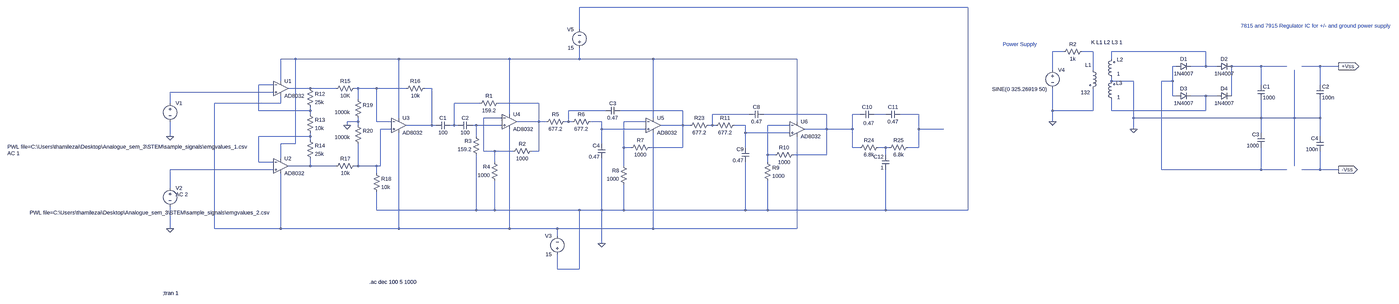
[diagram p0: schematic complete.asc, whole sheet]
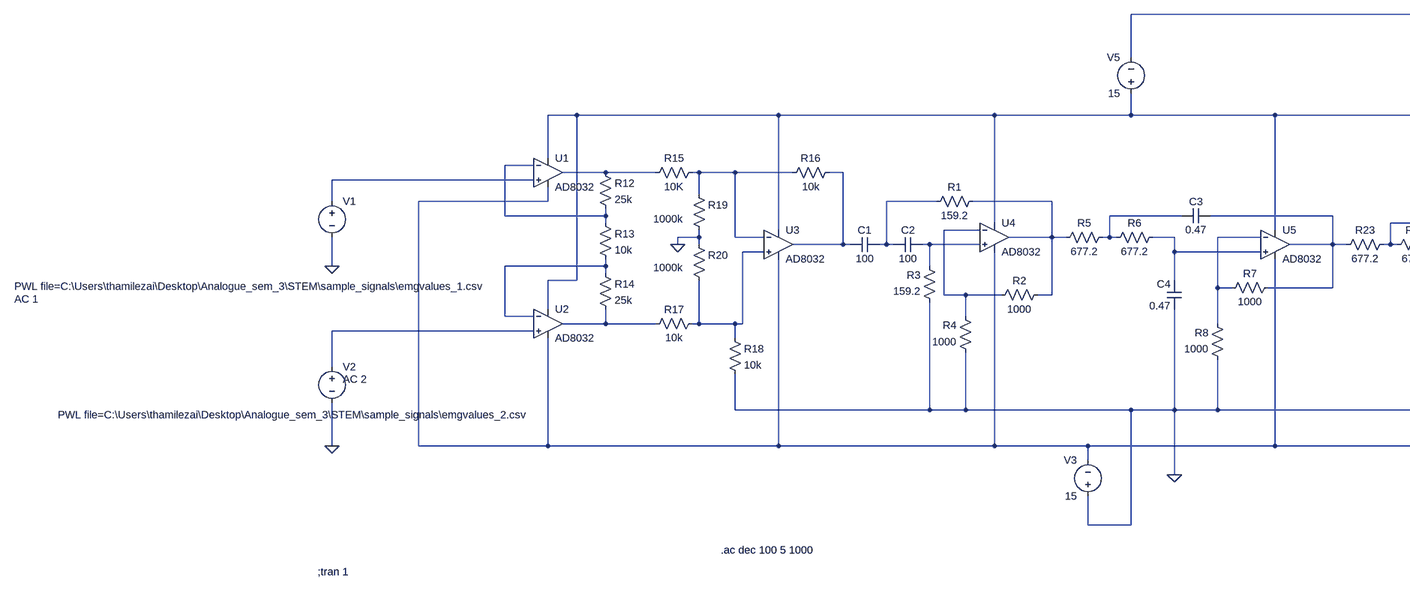
[diagram p1: schematic complete.asc, part, row 1 of 1, column 1 of 2]
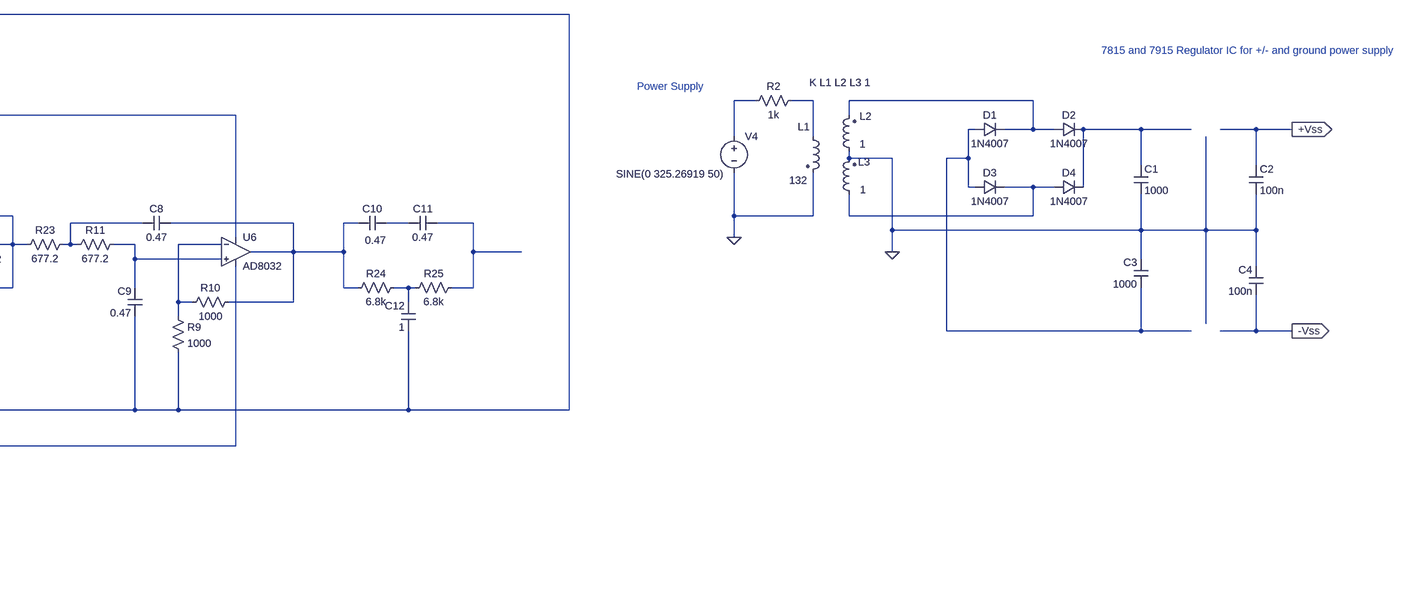
[diagram p2: schematic complete.asc, part, row 1 of 1, column 2 of 2]
complete.asc, the LTspice schematic file:
Version 4
SHEET 1 3992 3368
WIRE -784 912 -2528 912
WIRE -2528 1008 -2528 912
WIRE 272 1104 224 1104
WIRE 400 1104 352 1104
WIRE 944 1104 480 1104
WIRE -3760 1136 -3824 1136
WIRE -3312 1136 -3760 1136
WIRE -2832 1136 -3312 1136
WIRE -2528 1136 -2528 1088
WIRE -2528 1136 -2832 1136
WIRE -2208 1136 -2528 1136
WIRE -1584 1136 -2208 1136
WIRE 480 1136 480 1104
WIRE 816 1168 800 1168
WIRE 944 1168 944 1104
WIRE 944 1168 880 1168
WIRE 992 1168 944 1168
WIRE 1184 1168 1056 1168
WIRE 1296 1168 1184 1168
WIRE 1440 1168 1360 1168
WIRE 1520 1168 1440 1168
WIRE 224 1184 224 1104
WIRE 400 1184 400 1104
WIRE -3824 1232 -3824 1136
WIRE 480 1232 480 1216
WIRE 576 1232 480 1232
WIRE 800 1232 800 1168
WIRE 800 1232 752 1232
WIRE -3856 1248 -3920 1248
WIRE 1184 1248 1184 1168
WIRE 1440 1248 1440 1168
WIRE -3696 1264 -3792 1264
WIRE -3584 1264 -3696 1264
WIRE -3488 1264 -3504 1264
WIRE -3408 1264 -3488 1264
WIRE -3280 1264 -3408 1264
WIRE -3168 1264 -3200 1264
WIRE -3856 1280 -4304 1280
WIRE 800 1296 800 1232
WIRE 816 1296 800 1296
WIRE 944 1296 880 1296
WIRE 992 1296 944 1296
WIRE 1056 1296 1056 1168
WIRE -3488 1312 -3488 1264
WIRE -4304 1328 -4304 1280
WIRE -3824 1328 -3824 1296
WIRE -3824 1328 -4112 1328
WIRE -2960 1328 -3072 1328
WIRE -2704 1328 -2880 1328
WIRE -3920 1360 -3920 1248
WIRE -3696 1360 -3696 1344
WIRE -3696 1360 -3920 1360
WIRE -2416 1360 -2576 1360
WIRE -2080 1360 -2352 1360
WIRE 224 1360 224 1264
WIRE 400 1360 400 1264
WIRE 400 1360 224 1360
WIRE 480 1360 480 1312
WIRE 944 1360 944 1296
WIRE 944 1360 480 1360
WIRE -3696 1376 -3696 1360
WIRE -2832 1376 -2832 1136
WIRE -1792 1376 -1952 1376
WIRE -1456 1376 -1728 1376
WIRE -1312 1376 -1344 1376
WIRE -1200 1376 -1248 1376
WIRE -1056 1376 -1136 1376
WIRE -3312 1392 -3312 1136
WIRE -2864 1392 -2944 1392
WIRE -2208 1392 -2208 1136
WIRE 576 1392 576 1232
WIRE 1184 1392 1184 1312
WIRE 1184 1392 576 1392
WIRE 1328 1392 1328 1184
WIRE 1328 1392 1184 1392
WIRE 1440 1392 1440 1312
WIRE 1440 1392 1328 1392
WIRE -3488 1408 -3488 1392
WIRE -3488 1408 -3536 1408
WIRE -3408 1408 -3408 1264
WIRE -3344 1408 -3408 1408
WIRE -2704 1408 -2704 1328
WIRE -2704 1408 -2800 1408
WIRE -2672 1408 -2704 1408
WIRE -2576 1408 -2576 1360
WIRE -2576 1408 -2592 1408
WIRE -2560 1408 -2576 1408
WIRE -2432 1408 -2480 1408
WIRE -2240 1408 -2336 1408
WIRE -1584 1408 -1584 1136
WIRE 224 1408 224 1360
WIRE -3536 1424 -3536 1408
WIRE -3488 1424 -3488 1408
WIRE -3168 1424 -3168 1264
WIRE -3168 1424 -3280 1424
WIRE -3152 1424 -3168 1424
WIRE -3072 1424 -3072 1328
WIRE -3072 1424 -3088 1424
WIRE -3056 1424 -3072 1424
WIRE -2976 1424 -2992 1424
WIRE -2864 1424 -2976 1424
WIRE -2080 1424 -2080 1360
WIRE -2080 1424 -2176 1424
WIRE -2048 1424 -2080 1424
WIRE -1952 1424 -1952 1376
WIRE -1952 1424 -1968 1424
WIRE -1936 1424 -1952 1424
WIRE -1808 1424 -1856 1424
WIRE -1616 1424 -1712 1424
WIRE -3344 1440 -3392 1440
WIRE -2432 1440 -2432 1408
WIRE -2240 1440 -2432 1440
WIRE -1456 1440 -1456 1376
WIRE -1456 1440 -1552 1440
WIRE -1344 1440 -1344 1376
WIRE -1344 1440 -1456 1440
WIRE -1056 1440 -1056 1376
WIRE -912 1440 -1056 1440
WIRE 576 1440 576 1392
WIRE -1808 1456 -1808 1424
WIRE -1616 1456 -1808 1456
WIRE 1184 1456 1184 1392
WIRE -4304 1472 -4304 1408
WIRE -3696 1472 -3696 1456
WIRE -3696 1472 -3920 1472
WIRE -2976 1472 -2976 1424
WIRE 1440 1472 1440 1392
WIRE -3696 1488 -3696 1472
WIRE -3760 1504 -3760 1136
WIRE -3760 1504 -3824 1504
WIRE -2432 1504 -2432 1440
WIRE -2336 1520 -2336 1408
WIRE -2304 1520 -2336 1520
WIRE -2080 1520 -2080 1424
WIRE -2080 1520 -2224 1520
WIRE -1808 1520 -1808 1456
WIRE -1344 1520 -1344 1440
WIRE -1312 1520 -1344 1520
WIRE -1200 1520 -1232 1520
WIRE -1184 1520 -1200 1520
WIRE -1056 1520 -1056 1440
WIRE -1056 1520 -1104 1520
WIRE -2944 1536 -2944 1392
WIRE -2896 1536 -2944 1536
WIRE -2816 1536 -2896 1536
WIRE -2704 1536 -2704 1408
WIRE -2704 1536 -2736 1536
WIRE -1712 1552 -1712 1424
WIRE -1680 1552 -1712 1552
WIRE -1456 1552 -1456 1440
WIRE -1456 1552 -1600 1552
WIRE -1200 1552 -1200 1520
WIRE -3824 1568 -3824 1504
WIRE -3920 1584 -3920 1472
WIRE -3856 1584 -3920 1584
WIRE -2896 1584 -2896 1536
WIRE -1712 1584 -1712 1552
WIRE -3696 1600 -3696 1568
WIRE -3696 1600 -3792 1600
WIRE -3584 1600 -3696 1600
WIRE -3488 1600 -3488 1504
WIRE -3488 1600 -3504 1600
WIRE -3408 1600 -3488 1600
WIRE -3392 1600 -3392 1440
WIRE -3392 1600 -3408 1600
WIRE -2336 1600 -2336 1520
WIRE 1328 1600 1328 1392
WIRE -3856 1616 -4304 1616
WIRE 752 1616 752 1232
WIRE 1184 1616 1184 1520
WIRE 1184 1616 752 1616
WIRE 1296 1616 1184 1616
WIRE 1440 1616 1440 1536
WIRE 1440 1616 1360 1616
WIRE 1520 1616 1440 1616
WIRE -3408 1632 -3408 1600
WIRE -4304 1696 -4304 1616
WIRE -3408 1792 -3408 1712
WIRE -2976 1792 -2976 1552
WIRE -2976 1792 -3408 1792
WIRE -2896 1792 -2896 1664
WIRE -2896 1792 -2976 1792
WIRE -2528 1792 -2896 1792
WIRE -2432 1792 -2432 1568
WIRE -2432 1792 -2528 1792
WIRE -2336 1792 -2336 1680
WIRE -2336 1792 -2432 1792
WIRE -1808 1792 -1808 1584
WIRE -1808 1792 -2336 1792
WIRE -1712 1792 -1712 1664
WIRE -1712 1792 -1808 1792
WIRE -1200 1792 -1200 1616
WIRE -1200 1792 -1712 1792
WIRE -784 1792 -784 912
WIRE -784 1792 -1200 1792
WIRE -4304 1872 -4304 1776
WIRE -4112 1872 -4112 1328
WIRE -3824 1872 -3824 1632
WIRE -3824 1872 -4112 1872
WIRE -3312 1872 -3312 1456
WIRE -3312 1872 -3824 1872
WIRE -2832 1872 -2832 1440
WIRE -2832 1872 -3312 1872
WIRE -2624 1872 -2832 1872
WIRE -2208 1872 -2208 1456
WIRE -2208 1872 -2624 1872
WIRE -1584 1872 -1584 1472
WIRE -1584 1872 -2208 1872
WIRE -2624 1904 -2624 1872
WIRE -2432 1936 -2432 1792
WIRE -2624 2048 -2624 1984
WIRE -2528 2048 -2528 1792
WIRE -2528 2048 -2624 2048
FLAG -2432 1936 0
FLAG -4304 1472 0
FLAG -4304 1872 0
FLAG -3536 1424 0
FLAG 224 1408 0
FLAG 576 1440 0
FLAG 1520 1168 +Vss
IOPIN 1520 1168 Out
FLAG 1520 1616 -Vss
IOPIN 1520 1616 Out
SYMBOL cap -3088 1408 R90
WINDOW 0 0 32 VBottom 2
WINDOW 3 32 32 VTop 2
SYMATTR InstName C1
SYMATTR Value 100
SYMBOL cap -2992 1408 R90
WINDOW 0 0 32 VBottom 2
WINDOW 3 32 32 VTop 2
SYMATTR InstName C2
SYMATTR Value 100
SYMBOL res -2864 1312 R90
WINDOW 0 0 56 VBottom 2
WINDOW 3 32 56 VTop 2
SYMATTR InstName R1
SYMATTR Value 159.2
SYMBOL res -2720 1520 R90
WINDOW 0 0 56 VBottom 2
WINDOW 3 32 56 VTop 2
SYMATTR InstName R2
SYMATTR Value 1000
SYMBOL res -2960 1568 R180
WINDOW 0 36 76 Left 2
WINDOW 3 36 40 Left 2
SYMATTR InstName R3
SYMATTR Value 159.2
SYMBOL res -2880 1680 R180
WINDOW 0 36 76 Left 2
WINDOW 3 36 40 Left 2
SYMATTR InstName R4
SYMATTR Value 1000
SYMBOL res -2576 1392 R90
WINDOW 0 0 56 VBottom 2
WINDOW 3 32 56 VTop 2
SYMATTR InstName R5
SYMATTR Value 677.2
SYMBOL res -2464 1392 R90
WINDOW 0 0 56 VBottom 2
WINDOW 3 32 56 VTop 2
SYMATTR InstName R6
SYMATTR Value 677.2
SYMBOL res -2208 1504 R90
WINDOW 0 0 56 VBottom 2
WINDOW 3 32 56 VTop 2
SYMATTR InstName R7
SYMATTR Value 1000
SYMBOL res -2320 1696 R180
WINDOW 0 36 76 Left 2
WINDOW 3 36 40 Left 2
SYMATTR InstName R8
SYMATTR Value 1000
SYMBOL cap -2352 1344 R90
WINDOW 0 0 32 VBottom 2
WINDOW 3 32 32 VTop 2
SYMATTR InstName C3
SYMATTR Value 0.47
SYMBOL cap -2416 1568 R180
WINDOW 0 24 56 Left 2
WINDOW 3 24 8 Left 2
SYMATTR InstName C4
SYMATTR Value 0.47
SYMBOL res -3712 1248 R0
SYMATTR InstName R12
SYMATTR Value 25k
SYMBOL res -3712 1360 R0
SYMATTR InstName R13
SYMATTR Value 10k
SYMBOL res -3712 1472 R0
SYMATTR InstName R14
SYMATTR Value 25k
SYMBOL res -3488 1248 R90
WINDOW 0 0 56 VBottom 2
WINDOW 3 32 56 VTop 2
SYMATTR InstName R15
SYMATTR Value 10K
SYMBOL res -3184 1248 R90
WINDOW 0 0 56 VBottom 2
WINDOW 3 32 56 VTop 2
SYMATTR InstName R16
SYMATTR Value 10k
SYMBOL res -3488 1584 R90
WINDOW 0 0 56 VBottom 2
WINDOW 3 32 56 VTop 2
SYMATTR InstName R17
SYMATTR Value 10k
SYMBOL res -3424 1616 R0
SYMATTR InstName R18
SYMATTR Value 10k
SYMBOL res -3504 1296 R0
WINDOW 3 -86 71 Left 2
SYMATTR Value 1000k
SYMATTR InstName R19
SYMBOL res -3504 1408 R0
WINDOW 3 -86 67 Left 2
SYMATTR Value 1000k
SYMATTR InstName R20
SYMBOL voltage -4304 1312 R0
WINDOW 3 -706 205 Left 2
WINDOW 123 -706 233 Left 2
WINDOW 39 0 0 Left 0
SYMATTR Value PWL file=C:\Users\thamilezai\Desktop\Analogue_sem_3\STEM\sample_signals\emgvalues_1.csv
SYMATTR Value2 AC 1
SYMATTR InstName V1
SYMBOL voltage -4304 1680 R0
WINDOW 3 -609 123 Left 2
WINDOW 123 24 44 Left 2
WINDOW 39 0 0 Left 0
SYMATTR Value PWL file=C:\Users\thamilezai\Desktop\Analogue_sem_3\STEM\sample_signals\emgvalues_2.csv
SYMATTR Value2 AC 2
SYMATTR InstName V2
SYMBOL voltage -2624 2000 R180
WINDOW 0 24 96 Left 2
WINDOW 3 24 16 Left 2
WINDOW 123 0 0 Left 0
WINDOW 39 0 0 Left 0
SYMATTR InstName V3
SYMATTR Value 15
SYMBOL voltage -2528 1104 R180
WINDOW 0 24 96 Left 2
WINDOW 3 24 16 Left 2
WINDOW 123 0 0 Left 0
WINDOW 39 0 0 Left 0
SYMATTR InstName V5
SYMATTR Value 15
SYMBOL OpAmps\\AD8032 -3824 1200 R0
SYMATTR InstName U1
SYMBOL OpAmps\\AD8032 -3824 1536 R0
SYMATTR InstName U2
SYMBOL OpAmps\\AD8032 -3312 1360 R0
SYMATTR InstName U3
SYMBOL OpAmps\\AD8032 -2832 1344 R0
SYMATTR InstName U4
SYMBOL OpAmps\\AD8032 -2208 1360 R0
SYMATTR InstName U5
SYMBOL res -1840 1408 R90
WINDOW 0 0 56 VBottom 2
WINDOW 3 32 56 VTop 2
SYMATTR InstName R11
SYMATTR Value 677.2
SYMBOL cap -1728 1360 R90
WINDOW 0 0 32 VBottom 2
WINDOW 3 32 32 VTop 2
SYMATTR InstName C8
SYMATTR Value 0.47
SYMBOL cap -1792 1584 R180
WINDOW 0 24 56 Left 2
WINDOW 3 24 8 Left 2
SYMATTR InstName C9
SYMATTR Value 0.47
SYMBOL OpAmps\\AD8032 -1584 1376 R0
SYMATTR InstName U6
SYMBOL res -1952 1408 R90
WINDOW 0 0 56 VBottom 2
WINDOW 3 32 56 VTop 2
SYMATTR InstName R23
SYMATTR Value 677.2
SYMBOL cap -1248 1360 R90
WINDOW 0 0 32 VBottom 2
WINDOW 3 39 25 VTop 2
SYMATTR InstName C10
SYMATTR Value 0.47
SYMBOL cap -1136 1360 R90
WINDOW 0 0 32 VBottom 2
WINDOW 3 32 32 VTop 2
SYMATTR InstName C11
SYMATTR Value 0.47
SYMBOL res -1216 1504 R90
WINDOW 0 0 56 VBottom 2
WINDOW 3 32 56 VTop 2
SYMATTR InstName R24
SYMATTR Value 6.8k
SYMBOL res -1088 1504 R90
WINDOW 0 0 56 VBottom 2
WINDOW 3 32 56 VTop 2
SYMATTR InstName R25
SYMATTR Value 6.8k
SYMBOL cap -1184 1616 R180
WINDOW 0 24 56 Left 2
WINDOW 3 24 8 Left 2
SYMATTR InstName C12
SYMATTR Value 1
SYMBOL res -1728 1568 R0
SYMATTR InstName R9
SYMATTR Value 1000
SYMBOL res -1584 1536 R90
WINDOW 0 0 56 VBottom 2
WINDOW 3 32 56 VTop 2
SYMATTR InstName R10
SYMATTR Value 1000
SYMBOL voltage 224 1168 R0
WINDOW 3 -262 99 Left 2
WINDOW 123 0 0 Left 0
WINDOW 39 0 0 Left 0
SYMATTR Value SINE(0 325.26919 50)
SYMATTR InstName V4
SYMBOL ind2 384 1168 R0
WINDOW 0 -18 -6 Left 2
WINDOW 3 -37 113 Left 2
SYMATTR InstName L1
SYMATTR Value 132
SYMATTR Type ind
SYMBOL ind2 496 1232 R180
WINDOW 0 -34 93 Left 2
WINDOW 3 -21 32 Left 2
SYMATTR InstName L2
SYMATTR Value 1
SYMATTR Type ind
SYMBOL res 368 1088 R90
WINDOW 0 0 56 VBottom 2
WINDOW 3 32 56 VTop 2
SYMATTR InstName R2
SYMATTR Value 1k
SYMBOL diode 816 1184 R270
WINDOW 0 32 32 VTop 2
WINDOW 3 0 32 VBottom 2
SYMATTR InstName D1
SYMATTR Value 1N4007
SYMBOL diode 992 1184 R270
WINDOW 0 32 32 VTop 2
WINDOW 3 0 32 VBottom 2
SYMATTR InstName D2
SYMATTR Value 1N4007
SYMBOL diode 816 1312 R270
WINDOW 0 32 32 VTop 2
WINDOW 3 0 32 VBottom 2
SYMATTR InstName D3
SYMATTR Value 1N4007
SYMBOL diode 992 1312 R270
WINDOW 0 32 32 VTop 2
WINDOW 3 0 32 VBottom 2
SYMATTR InstName D4
SYMATTR Value 1N4007
SYMBOL cap 1168 1248 R0
SYMATTR InstName C1
SYMATTR Value 1000
SYMBOL cap 1424 1248 R0
SYMATTR InstName C2
SYMATTR Value 100n
SYMBOL ind2 496 1328 R180
WINDOW 0 -31 88 Left 2
WINDOW 3 -22 26 Left 2
SYMATTR InstName L3
SYMATTR Value 1
SYMATTR Type ind
SYMBOL cap 1200 1456 M0
SYMATTR InstName C3
SYMATTR Value 1000
SYMBOL cap 1456 1472 M0
SYMATTR InstName C4
SYMATTR Value 100n
TEXT -4336 2152 Left 2 !;tran 1
TEXT -3440 2104 Left 2 !.ac dec 100 5 1000
TEXT 8 1072 Left 2 ;Power Supply
TEXT 392 1064 Left 2 !K L1 L2 L3 1
TEXT 1096 992 Left 2 ;7815 and 7915 Regulator IC for +/- and ground power supply

The netlist it stands for:
* complete.asc
C1 N014 N010 100
C2 N025 N014 100
R1 N015 N014 159.2
R2 N015 N022 1000
R3 0 N025 159.2
R4 0 N022 1000
R5 N016 N015 677.2
R6 N023 N016 677.2
R7 N017 N024 1000
R8 0 N024 1000
C3 N017 N016 0.47
C4 0 N023 0.47
R12 N008 N007 25k
R13 N007 N029 10k
R14 N029 N031 25k
R15 N009 N008 10K
R16 N010 N009 10k
R17 N028 N031 10k
R18 N028 0 10k
R19 N009 0 1000k
R20 0 N028 1000k
V1 N011 0 PWL file=C:\Users\thamilezai\Desktop\Analogue_sem_3\STEM\sample_signals\emgvalues_1.csv AC 1
V2 N032 0 PWL file=C:\Users\thamilezai\Desktop\Analogue_sem_3\STEM\sample_signals\emgvalues_2.csv AC 2
V3 0 N013 15
V5 N004 0 15
XU1 N011 N007 N004 N013 N008 AD8032  ; pins In+ In- V+ V- OUT
XU2 N032 N029 N004 N013 N031 AD8032  ; pins In+ In- V+ V- OUT
XU3 N028 N009 N004 N013 N010 AD8032  ; pins In+ In- V+ V- OUT
XU4 N025 N022 N004 N013 N015 AD8032  ; pins In+ In- V+ V- OUT
XU5 N023 N024 N004 N013 N017 AD8032  ; pins In+ In- V+ V- OUT
R11 N026 N018 677.2
C8 N019 N018 0.47
C9 0 N026 0.47
XU6 N026 N027 N004 N013 N019 AD8032  ; pins In+ In- V+ V- OUT
R23 N018 N017 677.2
C10 N020 N019 0.47
C11 N021 N020 0.47
R24 N030 N019 6.8k
R25 N021 N030 6.8k
C12 0 N030 1
R9 N027 0 1000
R10 N019 N027 1000
V4 N001 0 SINE(0 325.26919 50)
L1 N002 0 132
L2 0 N003 1
R2 N002 N001 1k
D1 N005 N003 1N4007
D2 N003 N006 1N4007
D3 N005 N012 1N4007
D4 N012 N006 1N4007
C1 N006 0 1000
C2 +Vss 0 100n
L3 N012 0 1
C3 0 N005 1000
C4 0 -Vss 100n
.model D D
.lib standard.dio
;tran 1
.ac dec 100 5 1000
* Power Supply
K L1 L2 L3 1
* 7815 and 7915 Regulator IC for +/- and ground power supply
.backanno
.end